# Altium project AD_sensors.PrjPcb
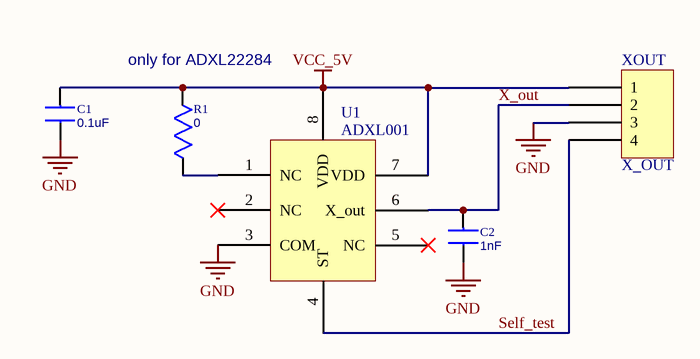
[diagram p0: ADXL001.SchDoc]
3 sheets, 14 parts. Net scope: flat (ports and power ports of the same name join across sheets).
Board file: ADXL001.PcbDoc
Sheets:
  ADXL001.SchDoc
  ADXL192(AD22282_AD22283).SchDoc
  ADXL278(AD22286).SchDoc

## Sheet ADXL001.SchDoc
size A4

### Parts
(Parts that share a designator on the sheet are numbered #1, #2 ... from top to bottom, then left to right.)
C1#1  0.1uF  [C_0805]
C2#1  1nF  [C_0805]
R1  only for ADXL22284  value 0  [R_0805]
U1#1  ADXL001  [E-8-1]
XOUT#1  X_OUT  [4_pin_plate_conn]

### Nets
GND: C1#1.1 C2#1.1 U1#1.3(COM) XOUT#1.3
VCC_5V: C1#1.2 R1.1 U1#1.7(VDD) U1#1.8(VDD) XOUT#1.1
Self_test: U1#1.4(ST) XOUT#1.4
X_out: C2#1.2 U1#1.6(X_out) XOUT#1.2
NetR1_2: R1.2 U1#1.1(NC)

Not connected (* = marked no-connect by the designer): U1#1 2(NC)* 5(NC)*

### Library data of the parts
C1#1 C2#1 = C0805: Capacitor
  C1#1: Value: 0.1uF
  C2#1: Value: 1nF
R1 = R0805: Resistor
U1#1 = ADXL001: Analog devices accelerometer
XOUT#1 = 4_pin_plate_conn

## Sheet ADXL192(AD22282_AD22283).SchDoc
size A4
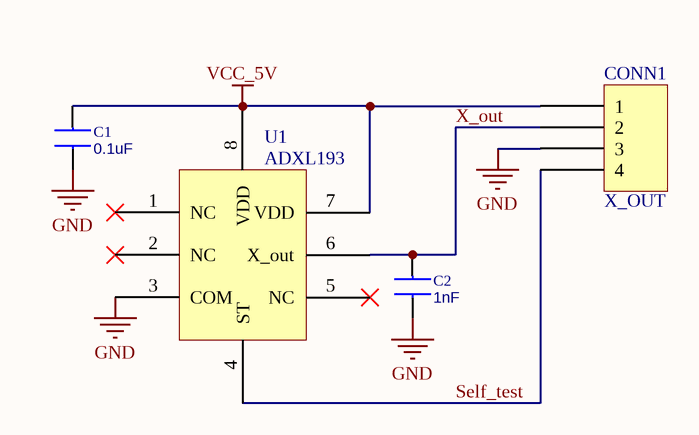
[diagram p1: ADXL192(AD22282_AD22283).SchDoc]

### Parts
(Parts that share a designator on the sheet are numbered #1, #2 ... from top to bottom, then left to right.)
C1#2  0.1uF  [C_0805]
C2#2  1nF  [C_0805]
CONN1  X_OUT  [4_pin_plate_conn]
U1#2  ADXL193  [E-8-1]

### Nets
GND: C1#2.1 C2#2.1 CONN1.3 U1#2.3(COM)
VCC_5V: C1#2.2 CONN1.1 U1#2.7(VDD) U1#2.8(VDD)
Self_test: CONN1.4 U1#2.4(ST)
X_out: C2#2.2 CONN1.2 U1#2.6(X_out)

Not connected (* = marked no-connect by the designer): U1#2 1(NC)* 2(NC)* 5(NC)*

### Library data of the parts
C1#2 C2#2 = C0805: Capacitor
  C1#2: Value: 0.1uF
  C2#2: Value: 1nF
CONN1 = 4_pin_plate_conn
U1#2 = ADXL193: Analog devices accelerometer

## Sheet ADXL278(AD22286).SchDoc
size A4
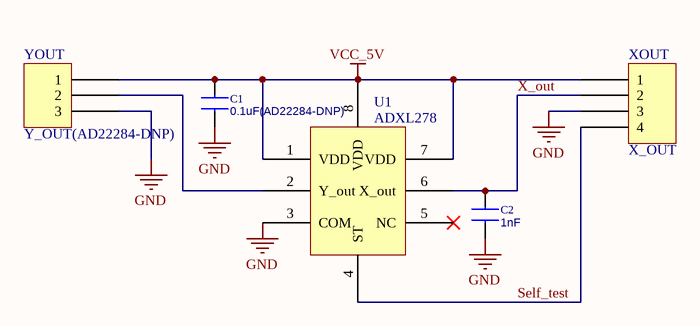
[diagram p2: ADXL278(AD22286).SchDoc]

### Parts
(Parts that share a designator on the sheet are numbered #1, #2 ... from top to bottom, then left to right.)
C1#3  0.1uF(AD22284-DNP)  [C_0805]
C2#3  1nF  [C_0805]
U1#3  ADXL278  [E-8-1]
XOUT#2  X_OUT  [4_pin_plate_conn]
YOUT  Y_OUT(AD22284-DNP)  [3_pin_plate_conn]

### Nets
GND: C1#3.1 C2#3.1 U1#3.3(COM) XOUT#2.3 YOUT.3
VCC_5V: C1#3.2 U1#3.1(VDD) U1#3.7(VDD) U1#3.8(VDD) XOUT#2.1 YOUT.1
Self_test: U1#3.4(ST) XOUT#2.4
X_out: C2#3.2 U1#3.6(X_out) XOUT#2.2
NetU1#3_2: U1#3.2(Y_out) YOUT.2

Not connected (* = marked no-connect by the designer): U1#3 5(NC)*

### Library data of the parts
C1#3 C2#3 = C0805: Capacitor
  C1#3: Value: 0.1uF(AD22284-DNP)
  C2#3: Value: 1nF
U1#3 = ADXL278: Analog devices accelerometer
XOUT#2 = 4_pin_plate_conn
YOUT = 3_pin_plate_conn

## Nets that join several sheets
GND: ADXL001 (C1#1.1 C2#1.1 U1#1.3 XOUT#1.3), ADXL192(AD22282_AD22283) (C1#2.1 C2#2.1 CONN1.3 U1#2.3), ADXL278(AD22286) (5 pins)
VCC_5V: ADXL001 (5 pins), ADXL192(AD22282_AD22283) (C1#2.2 CONN1.1 U1#2.7 U1#2.8), ADXL278(AD22286) (6 pins)